# EAGLE schematic dcdr_3.0 (EAGLE 7.7.0)
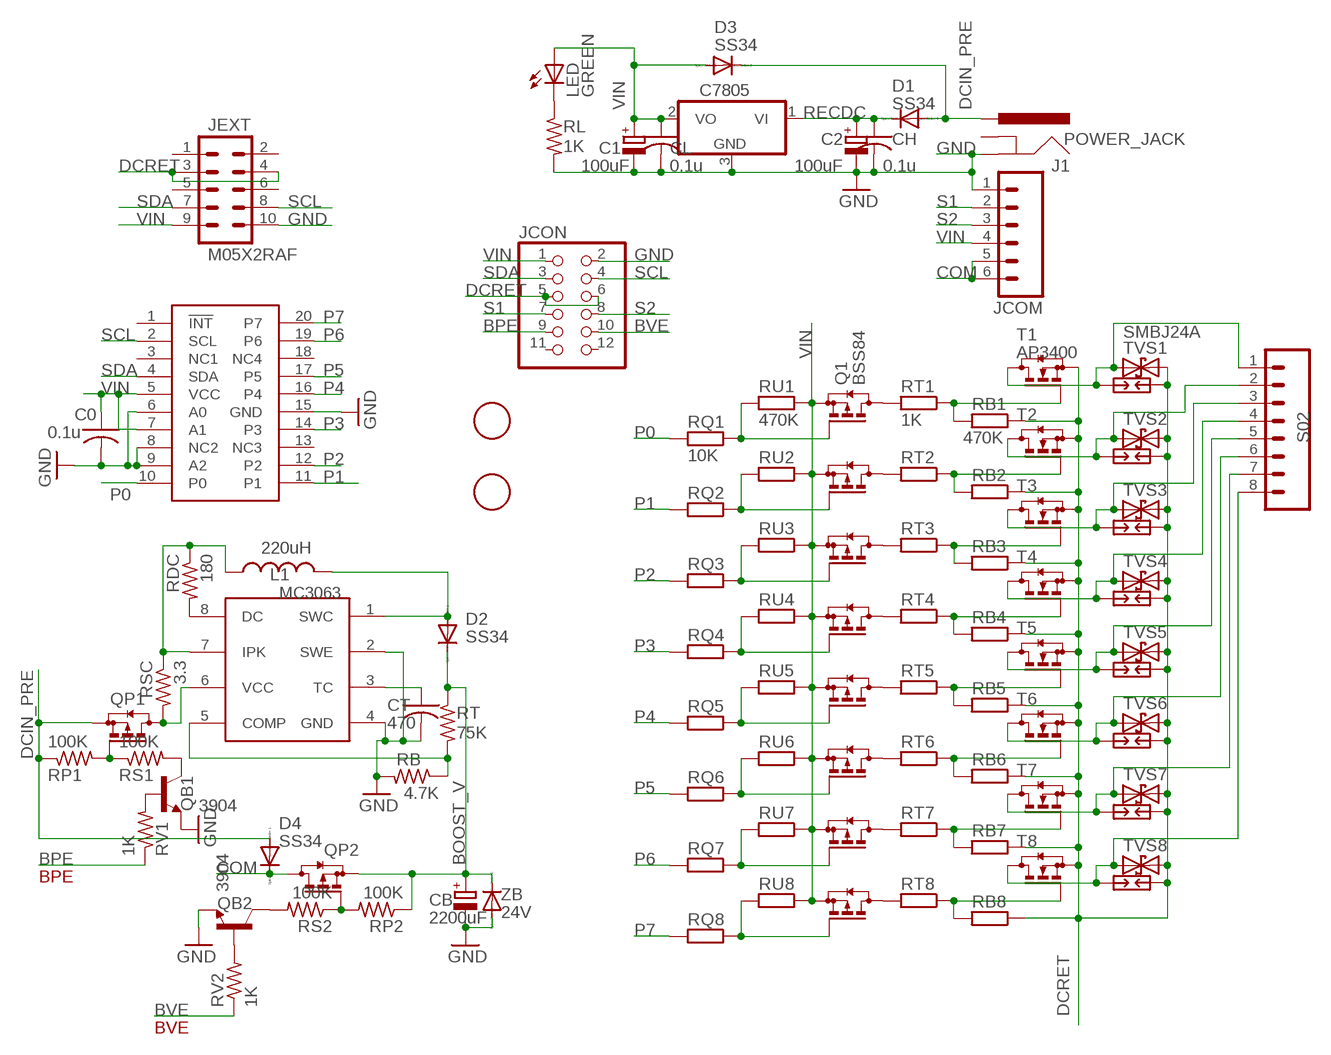
[diagram p0: schematic, sheet 1]

## Parts
C0  0.1u  C-USC0603  [C0603]
C1  100uF  CPOL-EUD  [PANASONIC_D]
C2  100uF  CPOL-EUD  [PANASONIC_D]
C7805  7805DT  [TO252]
CB  2200uF  CPOL-EUE7.5-16  [E7,5-16]
CH  0.1u  C-USC0603  [C0603]
CL  0.1u  C-USC0603  [C0603]
CT  470  C-USC0603K  [C0603K]
D1  SS34  DIODE-SMB  [SMB]
D2  SS34  DIODE-SMB  [SMB]
D3  SS34  DIODE-SMB  [SMB]
D4  SS34  DIODE-SMB  [SMB]
J1  POWER_JACK  POWER_JACKPTH_LOCK  [POWER_JACK_PTH_LOCK]
JCOM  M065MM  [SCREWTERMINAL-5MM-6]
JCON  PINHD-2X6  [2X06]
JEXT  M05X2RAF  [2X5-RAF]
L1  220uH  INDUCTORCR54  [CR54]
LED  GREEN  LEDCHIPLED_0805  [CHIPLED_0805]
MC3063  MC33063/MC34063D  [SO08]
PCF8574  PCF8574  [SSOP20]
Q1  BSS84  [SOT23]
Q2  BSS84  [SOT23]
Q3  BSS84  [SOT23]
Q4  BSS84  [SOT23]
Q5  BSS84  [SOT23]
Q6  BSS84  [SOT23]
Q7  BSS84  [SOT23]
Q8  BSS84  [SOT23]
QB1  3904  TRANSISTOR_NPNSOT23-3  [SOT23-3]
QB2  3904  TRANSISTOR_NPNSOT23-3  [SOT23-3]
QP1  BSS84  [SOT23]
QP2  BSS84  [SOT23]
RB  4.7K  R-US_R0603  [R0603]
RB1  470K  R-EU_R0603  [R0603]
RB2  470K  R-EU_R0603  [R0603]
RB3  470K  R-EU_R0603  [R0603]
RB4  470K  R-EU_R0603  [R0603]
RB5  470K  R-EU_R0603  [R0603]
RB6  470K  R-EU_R0603  [R0603]
RB7  470K  R-EU_R0603  [R0603]
RB8  470K  R-EU_R0603  [R0603]
RDC  180  R-US_R0603  [R0603]
RL  1K  R-US_R0603  [R0603]
RP1  100K  R-US_R0603  [R0603]
RP2  100K  R-US_R0603  [R0603]
RQ1  10K  R-EU_R0603  [R0603]
RQ2  10K  R-EU_R0603  [R0603]
RQ3  10K  R-EU_R0603  [R0603]
RQ4  10K  R-EU_R0603  [R0603]
RQ5  10K  R-EU_R0603  [R0603]
RQ6  10K  R-EU_R0603  [R0603]
RQ7  10K  R-EU_R0603  [R0603]
RQ8  10K  R-EU_R0603  [R0603]
RS1  100K  R-US_R0603  [R0603]
RS2  100K  R-US_R0603  [R0603]
RSC  3.3  R-US_R0603  [R0603]
RT  75K  R-US_R0603  [R0603]
RT1  1K  R-EU_R0603  [R0603]
RT2  1K  R-EU_R0603  [R0603]
RT3  1K  R-EU_R0603  [R0603]
RT4  1K  R-EU_R0603  [R0603]
RT5  1K  R-EU_R0603  [R0603]
RT6  1K  R-EU_R0603  [R0603]
RT7  1K  R-EU_R0603  [R0603]
RT8  1K  R-EU_R0603  [R0603]
RU1  470K  R-EU_R0603  [R0603]
RU2  470K  R-EU_R0603  [R0603]
RU3  470K  R-EU_R0603  [R0603]
RU4  470K  R-EU_R0603  [R0603]
RU5  470K  R-EU_R0603  [R0603]
RU6  470K  R-EU_R0603  [R0603]
RU7  470K  R-EU_R0603  [R0603]
RU8  470K  R-EU_R0603  [R0603]
RV1  1K  R-US_R0603  [R0603]
RV2  1K  R-US_R0603  [R0603]
S02  M085MM-8  [SCREWTERMINAL-5MM-8]
SP1  PCB-SGAP  [PCB-SGAP]
SP2  PCB-SGAP  [PCB-SGAP]
SP3  PCB-SGAP  [PCB-SGAP]
SP4  PCB-SGAP  [PCB-SGAP]
SP5  PCB-SGAP  [PCB-SGAP]
SP6  PCB-SGAP  [PCB-SGAP]
SP7  PCB-SGAP  [PCB-SGAP]
SP8  PCB-SGAP  [PCB-SGAP]
T1  AP3400  BSS123  [SOT23]
T2  BSS123  [SOT23]
T3  BSS123  [SOT23]
T4  BSS123  [SOT23]
T5  BSS123  [SOT23]
T6  BSS123  [SOT23]
T7  BSS123  [SOT23]
T8  BSS123  [SOT23]
TVS1  SMBJ24A  TVSSMB  [SMB]
TVS2  TVSSMB  [SMB]
TVS3  TVSSMB  [SMB]
TVS4  TVSSMB  [SMB]
TVS5  TVSSMB  [SMB]
TVS6  TVSSMB  [SMB]
TVS7  TVSSMB  [SMB]
TVS8  TVSSMB  [SMB]
U$1  FIDUCIAL  [FIDUCIAL_1MM]
U$2  FIDUCIAL  [FIDUCIAL_1MM]
ZB  24V  DIODE-MINIMELF  [MINIMELF]

## Nets
BOOST_V: CB.+ D2.C QP2.2(S) RP2.1 RT.1 ZB.C
BPE: JCON.9 RV1.1
BVE: JCON.10 RV2.1
COM [power]: D4.C JCOM.5 JCOM.6 QP2.3(D)
DCIN_PRE: D1.A D3.C D4.A J1.PWR QP1.2(S) RP1.1
DCRET: JCON.5 JCON.6 JEXT.3 JEXT.4 RB1.1 RB2.1 RB3.1 RB4.1 RB5.1 RB6.1 RB7.1 RB8.1 SP1.1 SP2.1 SP3.1 SP4.1 SP5.1 SP6.1 SP7.1 SP8.1 T1.2(S) T2.2(S) T3.2(S) T4.2(S) T5.2(S) T6.2(S) T7.2(S) T8.2(S) TVS1.C TVS2.C TVS3.C TVS4.C TVS5.C TVS6.C TVS7.C TVS8.C
GND [power]: C0.2 C1.- C2.- C7805.3(GND) CB.- CH.2 CL.2 CT.2 J1.GND JCOM.1 JCON.2 JEXT.10 MC3063.2(SWE) MC3063.4(GND) PCF8574.6(A0) PCF8574.8(NC2) PCF8574.9(A2) PCF8574.15(GND) QB1.2(E) QB2.2(E) RB.2 RL.2 ZB.A
N$1: D2.A L1.P$2 MC3063.1(SWC)
N$2: Q1.3(D) RT1.2
N$3: Q2.3(D) RT2.2
N$4: Q3.3(D) RT3.2
N$5: Q4.3(D) RT4.2
N$6: Q5.3(D) RT5.2
N$7: Q6.3(D) RT6.2
N$8: RB1.2 RT1.1 T1.1(G)
N$9: RB2.2 RT2.1 T2.1(G)
N$10: Q7.3(D) RT7.2
N$11: Q8.3(D) RT8.2
N$12: Q1.1(G) RQ1.1 RU1.2
N$13: Q2.1(G) RQ2.1 RU2.2
N$14: Q3.1(G) RQ3.1 RU3.2
N$15: RB3.2 RT3.1 T3.1(G)
N$16: RB4.2 RT4.1 T4.1(G)
N$17: CT.1 MC3063.3(TC)
N$18: RB5.2 RT5.1 T5.1(G)
N$19: RB6.2 RT6.1 T6.1(G)
N$20: Q4.1(G) RQ4.1 RU4.2
N$21: RB7.2 RT7.1 T7.1(G)
N$22: RB8.2 RT8.1 T8.1(G)
N$23: Q5.1(G) RQ5.1 RU5.2
N$24: MC3063.8(DC) RDC.2
N$25: Q6.1(G) RQ6.1 RU6.2
N$26: L1.P$1 MC3063.7(IPK) RDC.1 RSC.1
N$27: MC3063.6(VCC) QP1.3(D) RSC.2
N$28: LED.C RL.1
N$29: MC3063.5(COMP) RB.1 RT.2
N$30: QP1.1(G) RP1.2 RS1.1
N$31: Q7.1(G) RQ7.1 RU7.2
N$32: Q8.1(G) RQ8.1 RU8.2
N$33: QB1.1(B) RV1.2
N$34: QB2.3(C) RS2.2
N$35: QB1.3(C) RS1.2
N$38: QP2.1(G) RP2.2 RS2.1
N$43: QB2.1(B) RV2.2
N$50 [power]: S02.1 SP1.2 T1.3(D) TVS1.A
N$51 [power]: S02.2 SP2.2 T2.3(D) TVS2.A
N$52 [power]: S02.3 SP3.2 T3.3(D) TVS3.A
N$53 [power]: S02.4 SP4.2 T4.3(D) TVS4.A
N$54 [power]: S02.5 SP5.2 T5.3(D) TVS5.A
N$55 [power]: S02.6 SP6.2 T6.3(D) TVS6.A
N$56 [power]: S02.7 SP7.2 T7.3(D) TVS7.A
N$57 [power]: S02.8 SP8.2 T8.3(D) TVS8.A
P0: PCF8574.10(P0) RQ1.2
P1: PCF8574.11(P1) RQ2.2
P2: PCF8574.12(P2) RQ3.2
P3: PCF8574.14(P3) RQ4.2
P4: PCF8574.16(P4) RQ5.2
P5: PCF8574.17(P5) RQ6.2
P6: PCF8574.19(P6) RQ7.2
P7: PCF8574.20(P7) RQ8.2
RECDC: C2.+ C7805.1(VI) CH.1 D1.C
S1: JCOM.2 JCON.7
S2: JCOM.3 JCON.8
SCL: JCON.4 JEXT.8 PCF8574.2(SCL)
SDA: JCON.3 JEXT.7 PCF8574.4(SDA)
VIN [power]: C0.1 C1.+ C7805.2(VO) CL.1 D3.A JCOM.4 JCON.1 JEXT.9 LED.A PCF8574.5(VCC) PCF8574.7(A1) Q1.2(S) Q2.2(S) Q3.2(S) Q4.2(S) Q5.2(S) Q6.2(S) Q7.2(S) Q8.2(S) RU1.1 RU2.1 RU3.1 RU4.1 RU5.1 RU6.1 RU7.1 RU8.1
Unconnected: J1.GNDBREAK JCON.11 JCON.12 JEXT.1 JEXT.2 JEXT.5 JEXT.6 PCF8574.1(!INT) PCF8574.3(NC1) PCF8574.13(NC3) PCF8574.18(NC4)

## Notes on the sheet
- BPE
- BVE

## Library data of the parts
C0 CH CL CT = adafruit:C-US: CAPACITOR, American symbol
C1 C2 = resistor:CPOL-EU: POLARIZED CAPACITOR, European symbol
C7805 = linear:78*: Positive VOLTAGE REGULATOR Source: http://cache.national.com/ds/LM/LM78L05.pdf http://www.fairchildsemi.com/ds/LM/LM7805.pdf
CB = rcl:CPOL-EU: POLARIZED CAPACITOR, European symbol
D1-D4 ZB = diode:DIODE-: DIODE
J1 = SparkFun:POWER_JACK: Power Jack This is the standard 5.5mm barrel jack for power. The PTH is the most common, proven, reliable, footprint. All others are experimental. The Slot footprint only works if the mill layer is transmitted to the PCB fab house so be warned. Spark Fun Electronics SKU : PRT-00119. Mating wall wart : TOL-00298 (and others)
JCOM = SparkFun:M06: Header 6 Standard 6-pin 0.1" header. Use with straight break away headers (SKU : PRT-00116), right angle break away headers (PRT-00553), swiss pins (PRT-00743), machine pins (PRT-00117), and female headers (PRT-00115). Molex polarized connector foot print use with SKU : PRT-08094 with associated crimp pins and housings. NOTES ON THE VARIANTS LOCK and LOCK_LONGPADS... This footprint was designed to help hold the alignment of a through-hole component (i.e. 6-pin header) while soldering it into place. You may notice that each hole has been shifted either up or down by 0.005 of an inch from it's more standard position (which is a perfectly straight line). This slight alteration caused the pins (the squares in the middle) to touch the edges of the holes. Because they are alternating, it causes a "brace" to hold the component in place. 0.005 has proven to be the perfect amount of "off-center" position when using our standard breakaway headers. Although looks a little odd when you look at the bare footprint, once you have a header in there, the alteration is very hard to notice. Also, if you push a header all the way into place, it is covered up entirely on the bottom side. This idea of altering the position of holes to aid alignment will be further integrated into the Sparkfun Library for other footprints. It can help hold any component with 3 or more connection pins.
JCON = pinhead:PINHD-2X6: PIN HEADER
JEXT = SparkFunNew:M05X2: Header 5x2 Standard 10-pin dual row 0.1" header. Commonly used with AVR-ISP. Use with Spark Fun Electronics SKU: PRT-00778
L1 = SparkFunNew:INDUCTOR: Inductors Basic Inductor/Choke - 0603 and 1206. Footprints are not proven and vary greatly between part numbers.
LED = adafruit:LED: LED OSRAM: - CHIPLED LG R971, LG N971, LY N971, LG Q971, LY Q971, LO R971, LY R971 LH N974, LH R974 LS Q976, LO Q976, LY Q976 LO Q996 - Hyper CHIPLED LW Q18S LB Q993, LB Q99A, LB R99A - SideLED LS A670, LO A670, LY A670, LG A670, LP A670 LB A673, LV A673, LT A673, LW A673 LH A674 LY A675 LS A676, LA A676, LO A676, LY A676, LW A676 LS A679, LY A679, LG A679 - Hyper Micro SIDELED® LS Y876, LA Y876, LO Y876, LY Y876 LT Y87S - SmartLED LW L88C, LW L88S LB L89C, LB L89S, LG L890 LS L89K, LO L89K, LY L89K LS L896, LA L896, LO L896, LY L896 - TOPLED LS T670, LO T670, LY T670, LG T670, LP T670 LSG T670, LSP T670, LSY T670, LOP T670, LYG T670 LG T671, LOG T671, LSG T671 LB T673, LV T673, LT T673, LW T673 LH T674 LS T676, LA T676, LO T676, LY T676, LB T676, LH T676, LSB T676, LW T676 LB T67C, LV T67C, LT T67C, LS T67K, LO T67K, LY T67K, LW E67C LS E67B, LA E67B, LO E67B, LY E67B, LB E67C, LV E67C, LT E67C LW T67C LS T679, LY T679, LG T679 LS T770, LO T770, LY T770, LG T770, LP T770 LB T773, LV T773, LT T773, LW T773 LH T774 LS E675, LA E675, LY E675, LS T675 LS T776, LA T776, LO T776, LY T776, LB T776 LHGB T686 LT T68C, LB T68C - Hyper Mini TOPLED® LB M676 - Mini TOPLED Santana® LG M470 LS M47K, LO M47K, LY M47K Source: http://www.osram.convergy.de/
MC3063 = adafruit:MC33063/MC34063: MC33063 and MC34063 Basic DC/DC converter with internal power-NPN transistor, 100KHz, 1.5A peak switch current. 3-40 input/output.
PCF8574 = SparkFunNew:PCF8574
Q1-Q8 QP1 QP2 = transistor-small-signal:BSS84: P-CHANNEL MOS FET
QB1 QB2 = SparkFunNew:TRANSISTOR_NPN: Transistor NPN BJT configuration in SOT23 package. MMBT2222 is the common NPN we use. Double check BCE configuration again layout.
RB RDC RP1 RP2 RS1 RS2 RSC RT RV1 RV2 = adafruitGood:R-US_: RESISTOR, American symbol
RB1-RB8 RQ1-RQ8 RT1-RT8 RU1-RU8 = rcl:R-EU_: RESISTOR, European symbol
RL = adafruit2013:R-US_: RESISTOR, American symbol
S02 = SparkFun:M08: Header 8 Standard 8-pin 0.1" header. Use with straight break away headers (SKU : PRT-00116), right angle break away headers (PRT-00553), swiss pins (PRT-00743), machine pins (PRT-00117), and female headers (PRT-00115).
SP1-SP8 = varistor:PCB-SGAP
T1-T8 = transistor-small-signal:BSS123: N-CHANNEL MOS FET
TVS1-TVS8 = SparkFunNew:TVS
U$1 U$2 = adafruitGood:FIDUCIAL: For use by pick and place machines to calibrate the vision/machine, 1mm By microbuilder.eu

## Net classes
0 default: width 0.203 mm, clearance 0.178 mm
1 power: width 0.203 mm, clearance 0.178 mm
2 relaypower: width 0.508 mm, clearance 0.508 mm